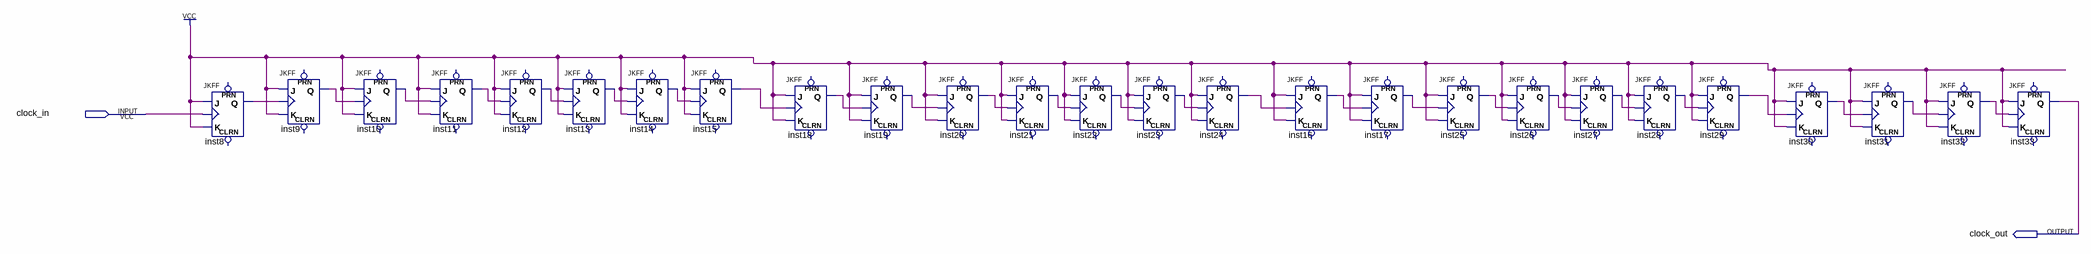
[diagram p0: schematic sheet]
// Quartus schematic Divisor26ff.bdf as structural Verilog: 26 symbols, 2 pins
module Divisor26ff (
  input  clock_in,
  output clock_out
);

  wire inst8_q, inst9_q, inst10_q, inst11_q, inst12_q, inst13_q, inst14_q, inst15_q, inst16_q, inst17_q,
       inst18_q, inst19_q, inst20_q, inst21_q, inst22_q, inst23_q, inst24_q, inst25_q, inst26_q, inst27_q,
       inst28_q, inst29_q, inst30_q, inst31_q, inst32_q;

  JKFF inst8 (.K(1'b1), .J(1'b1), .CLK(clock_in), .Q(inst8_q));  // open: PRN, CLRN
  JKFF inst9 (.K(1'b1), .J(1'b1), .CLK(inst8_q), .Q(inst9_q));  // open: PRN, CLRN
  JKFF inst10 (.K(1'b1), .J(1'b1), .CLK(inst9_q), .Q(inst10_q));  // open: PRN, CLRN
  JKFF inst11 (.K(1'b1), .J(1'b1), .CLK(inst10_q), .Q(inst11_q));  // open: PRN, CLRN
  JKFF inst12 (.K(1'b1), .J(1'b1), .CLK(inst11_q), .Q(inst12_q));  // open: PRN, CLRN
  JKFF inst13 (.K(1'b1), .J(1'b1), .CLK(inst12_q), .Q(inst13_q));  // open: PRN, CLRN
  JKFF inst14 (.K(1'b1), .J(1'b1), .CLK(inst13_q), .Q(inst14_q));  // open: PRN, CLRN
  JKFF inst15 (.K(1'b1), .J(1'b1), .CLK(inst14_q), .Q(inst15_q));  // open: PRN, CLRN
  JKFF inst18 (.K(1'b1), .J(1'b1), .CLK(inst15_q), .Q(inst18_q));  // open: PRN, CLRN
  JKFF inst19 (.K(1'b1), .J(1'b1), .CLK(inst18_q), .Q(inst19_q));  // open: PRN, CLRN
  JKFF inst20 (.K(1'b1), .J(1'b1), .CLK(inst19_q), .Q(inst20_q));  // open: PRN, CLRN
  JKFF inst21 (.K(1'b1), .J(1'b1), .CLK(inst20_q), .Q(inst21_q));  // open: PRN, CLRN
  JKFF inst22 (.K(1'b1), .J(1'b1), .CLK(inst21_q), .Q(inst22_q));  // open: PRN, CLRN
  JKFF inst23 (.K(1'b1), .J(1'b1), .CLK(inst22_q), .Q(inst23_q));  // open: PRN, CLRN
  JKFF inst24 (.K(1'b1), .J(1'b1), .CLK(inst23_q), .Q(inst24_q));  // open: PRN, CLRN
  JKFF inst16 (.K(1'b1), .J(1'b1), .CLK(inst24_q), .Q(inst16_q));  // open: PRN, CLRN
  JKFF inst17 (.K(1'b1), .J(1'b1), .CLK(inst16_q), .Q(inst17_q));  // open: PRN, CLRN
  JKFF inst25 (.K(1'b1), .J(1'b1), .CLK(inst17_q), .Q(inst25_q));  // open: PRN, CLRN
  JKFF inst26 (.K(1'b1), .J(1'b1), .CLK(inst25_q), .Q(inst26_q));  // open: PRN, CLRN
  JKFF inst27 (.K(1'b1), .J(1'b1), .CLK(inst26_q), .Q(inst27_q));  // open: PRN, CLRN
  JKFF inst28 (.K(1'b1), .J(1'b1), .CLK(inst27_q), .Q(inst28_q));  // open: PRN, CLRN
  JKFF inst29 (.K(1'b1), .J(1'b1), .CLK(inst28_q), .Q(inst29_q));  // open: PRN, CLRN
  JKFF inst30 (.K(1'b1), .J(1'b1), .CLK(inst29_q), .Q(inst30_q));  // open: PRN, CLRN
  JKFF inst31 (.K(1'b1), .J(1'b1), .CLK(inst30_q), .Q(inst31_q));  // open: PRN, CLRN
  JKFF inst32 (.K(1'b1), .J(1'b1), .CLK(inst31_q), .Q(inst32_q));  // open: PRN, CLRN
  JKFF inst33 (.K(1'b1), .J(1'b1), .CLK(inst32_q), .Q(clock_out));  // open: PRN, CLRN
endmodule
